# Altium schematic sheet MCU.SchDoc
size A4; SheetNumber: 1; SheetTotal: 3
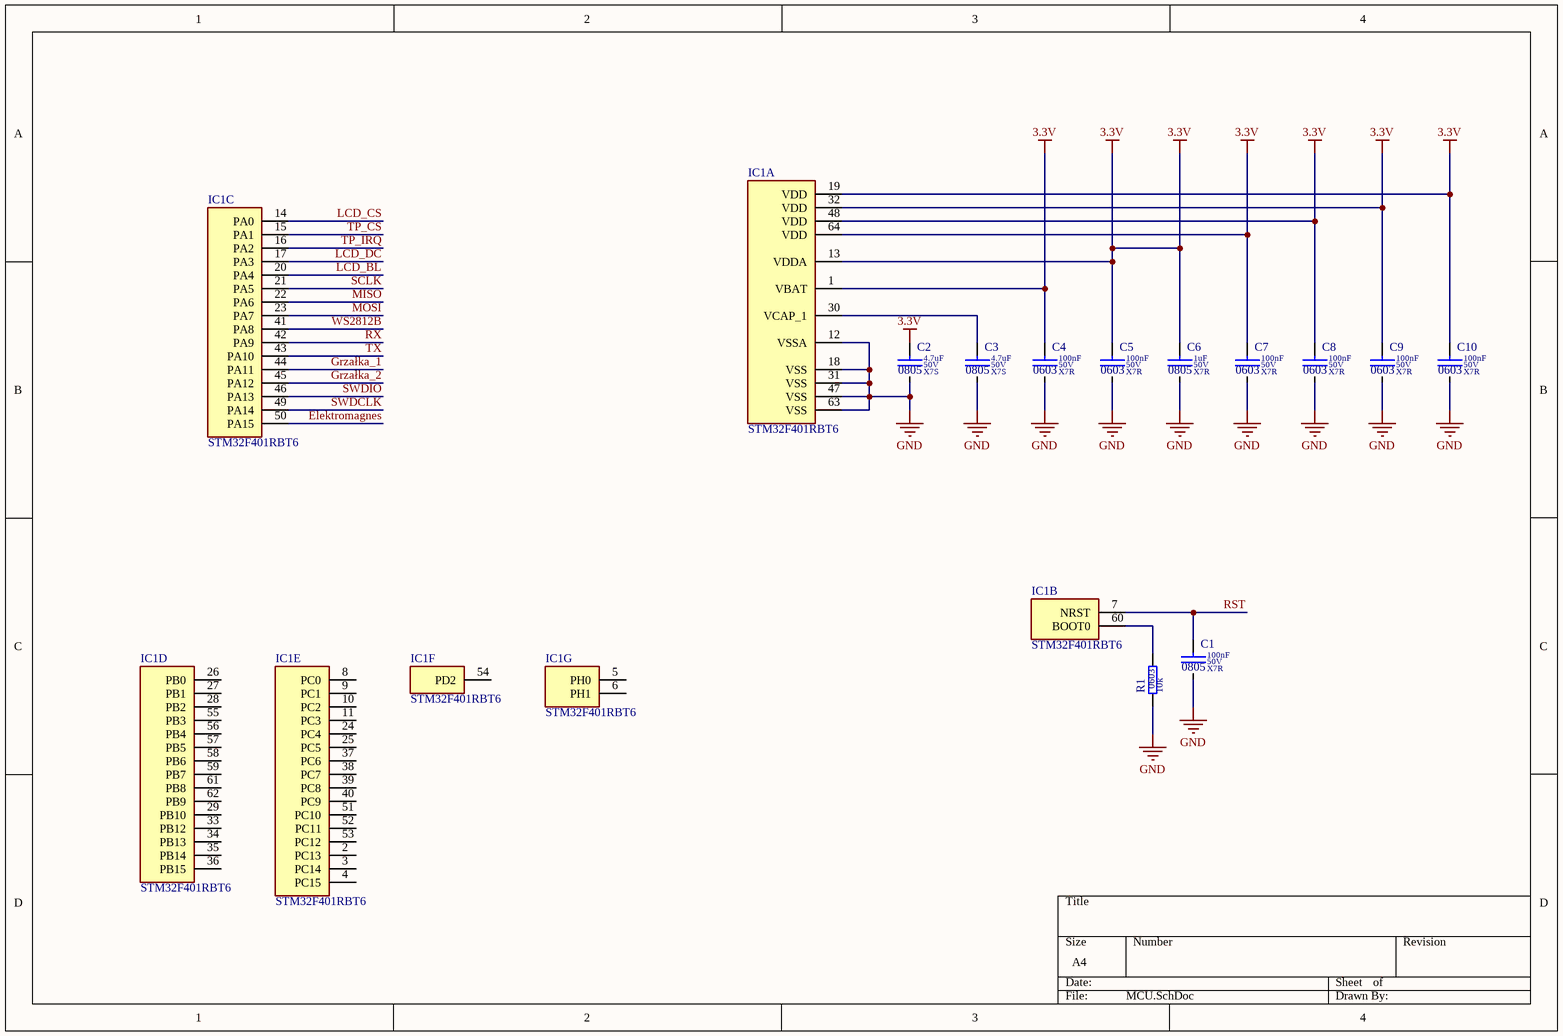
[diagram p0: MCU.SchDoc]

## Parts
C1  value 100nF  Dielectric: X7R  Voltage: 50V  SCH_Footprint: 0805  [C_0805_2012]  (hidden comment: Ceramic X7R)
C2  value 4.7uF  Dielectric: X7S  Voltage: 50V  SCH_Footprint: 0805  [C_0805_2012]  (hidden comment: Ceramic X7S)
C3  value 4.7uF  Dielectric: X7S  Voltage: 50V  SCH_Footprint: 0805  [C_0805_2012]  (hidden comment: Ceramic X7S)
C4  value 100nF  Dielectric: X7R  Voltage: 50V  SCH_Footprint: 0603  [C_0603_1608]  (hidden comment: Ceramic X7R)
C5  value 100nF  Dielectric: X7R  Voltage: 50V  SCH_Footprint: 0603  [C_0603_1608]  (hidden comment: Ceramic X7R)
C6  value 1uF  Dielectric: X7R  Voltage: 50V  SCH_Footprint: 0805  [C_0805_2012]  (hidden comment: Ceramic X7R)
C7  value 100nF  Dielectric: X7R  Voltage: 50V  SCH_Footprint: 0603  [C_0603_1608]  (hidden comment: Ceramic X7R)
C8  value 100nF  Dielectric: X7R  Voltage: 50V  SCH_Footprint: 0603  [C_0603_1608]  (hidden comment: Ceramic X7R)
C9  value 100nF  Dielectric: X7R  Voltage: 50V  SCH_Footprint: 0603  [C_0603_1608]  (hidden comment: Ceramic X7R)
C10  value 100nF  Dielectric: X7R  Voltage: 50V  SCH_Footprint: 0603  [C_0603_1608]  (hidden comment: Ceramic X7R)
IC1  STM32F401RBT6  [LQFP-64]  (parts A,B,C,D,E,F,G of 7)
R1  value 10k  SCH_Footprint: 0603  [R_0603_1608]  (hidden comment: Resistor)

## Nets
3.3V: C2.1 C4.1 C5.1 C6.1 C7.1 C8.1 C9.1 C10.1 IC1.1(VBAT) IC1.13(VDDA) IC1.19(VDD) IC1.32(VDD) IC1.48(VDD) IC1.64(VDD)
GND: C1.2 C2.2 C3.2 C4.2 C5.2 C6.2 C7.2 C8.2 C9.2 C10.2 IC1.12(VSSA) IC1.18(VSS) IC1.31(VSS) IC1.47(VSS) IC1.63(VSS) R1.1
Elektromagnes: IC1.50(PA15)
Grzałka_1: IC1.44(PA11)
Grzałka_2: IC1.45(PA12)
LCD_BL: IC1.20(PA4)
LCD_CS: IC1.14(PA0)
LCD_DC: IC1.17(PA3)
MISO: IC1.22(PA6)
MOSI: IC1.23(PA7)
RST: C1.1 IC1.7(NRST)
RX: IC1.42(PA9)
SCLK: IC1.21(PA5)
SWDCLK: IC1.49(PA14)
SWDIO: IC1.46(PA13)
TP_CS: IC1.15(PA1)
TP_IRQ: IC1.16(PA2)
TX: IC1.43(PA10)
WS2812B: IC1.41(PA8)
NetC3_1: C3.1 IC1.30(VCAP_1)
NetIC1_60: IC1.60(BOOT0) R1.2

Not connected (* = marked no-connect by the designer): IC1 2(PC13) 3(PC14) 4(PC15) 5(PH0) 6(PH1) 8(PC0) 9(PC1) 10(PC2) 11(PC3) 24(PC4) 25(PC5) 26(PB0) 27(PB1) 28(PB2) 29(PB10) 33(PB12) 34(PB13) 35(PB14) 36(PB15) 37(PC6) 38(PC7) 39(PC8) 40(PC9) 51(PC10) 52(PC11) 53(PC12) 54(PD2) 55(PB3) 56(PB4) 57(PB5) 58(PB6) 59(PB7) 61(PB8) 62(PB9)

## Library data of the parts
C1 = C_100nF_50V_X7R_0805_10: Capacitor; Manufacturer: AVX; Manufacturer Part Number: 08055C104K4T2A; Tolerance (%): 10; Part Number: C_100nF_50V_X7R_0805_10; HelpURL: http://www.tme.eu/pl/Document/943bdb20b23b898c4d4b2ec4eca4f2b6/cauto.pdf; Supplier 1: TME; Supplier Part Number 1: 08055C104K4T2A; Supplier 2: RS Components; Supplier 3: Farnell; Supplier 4: Mouser; Supplier 5: Digi-Key; Supplier 6: LCSC
C2 C3 = C_4.7uF_50V_X7S_0805_10: Capacitor; Manufacturer: Murata; Manufacturer Part Number: GRM21BC71H475KE11L; Tolerance (%): 10; Part Number: C_4.7uF_50V_X7S_0805_10; HelpURL: https://datasheet.octopart.com/GRM21BC71H475KE11L-Murata-datasheet-149523453.pdf; Supplier 1: TME; Supplier 2: RS Components; Supplier Part Number 2: 1726970; Supplier 3: Farnell; Supplier Part Number 3: 3582876; Supplier 4: Mouser; Supplier Part Number 4: 81-GRM21BC71H475KE1L; Supplier 5: Digi-Key; Supplier Part Number 5: 490-12757-1-ND; Supplier 6: LCSC
C4 C5 C7-C10 = C_100nF_50V_X7R_0603_5: Capacitor; Manufacturer: Samsung; Manufacturer Part Number: CL10B104JB8NNNC; Tolerance (%): 5; Part Number: C_100nF_50V_X7R_0603_5; HelpURL: http://www.tme.eu/pl/Document/4a42202b32dab16128fe107dd69598cc/samsung-chip-cap.pdf; Supplier 1: TME; Supplier Part Number 1: CL10B104JB8NNNC; Supplier 2: RS Components; Supplier Part Number 2: 7665455; Supplier 3: Farnell; Supplier 4: Mouser; Supplier 5: Digi-Key; Supplier Part Number 5: 1276-1033-1-ND; Supplier 6: LCSC; Supplier Part Number 6: C24452
C6 = C_1uF_50V_X7R_0805_10: Capacitor; Manufacturer: AVX; Manufacturer Part Number: 08055C105KAT2A; Tolerance (%): 10; Part Number: C_1uF_50V_X7R_0805_10; HelpURL: https://sigma.octopart.com/147443767/technical_drawing/AVX-08055C105KAT2A.pdf; Supplier 1: TME; Supplier Part Number 1: 08055C105KAT2A; Supplier 2: RS Components; Supplier Part Number 2: 1441427; Supplier 3: Farnell; Supplier Part Number 3: 2094043; Supplier 4: Mouser; Supplier Part Number 4: 581-08055C105KAT2A; Supplier 5: Digi-Key; Supplier Part Number 5: 478-7956-1-ND; Supplier 6: LCSC
IC1 = STM32F401RBT6: ARM Microcontroller
R1 = R_10k_0603_1: Manufacturer: Vishay; Manufacturer Part Number: CRCW060310K0FKTABC; Voltage: 75V; Power: 100mW; Tolerance: 1%; Part Number: R_10k_0603_1; HelpURL: http://www.tme.eu/pl/Document/622e28308c06d160637f2b14751ba16b/Data%20Sheet%20CRCW_BCe3.pdf; Supplier 1: TME; Supplier Part Number 1: CRCW060310K0FKTABC; Supplier 2: RS Components; Supplier 3: Farnell; Supplier 4: Mouser; Supplier Part Number 4: 667-ERJ-3EKF1002V; Supplier 5: Digi-Key; Supplier Part Number 5: P10KGCT-ND; Supplier 6: LCSC